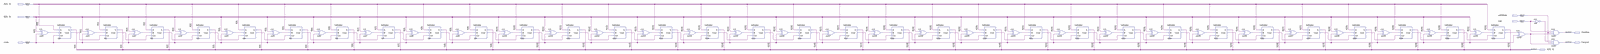
[diagram p0: schematic sheet, whole]
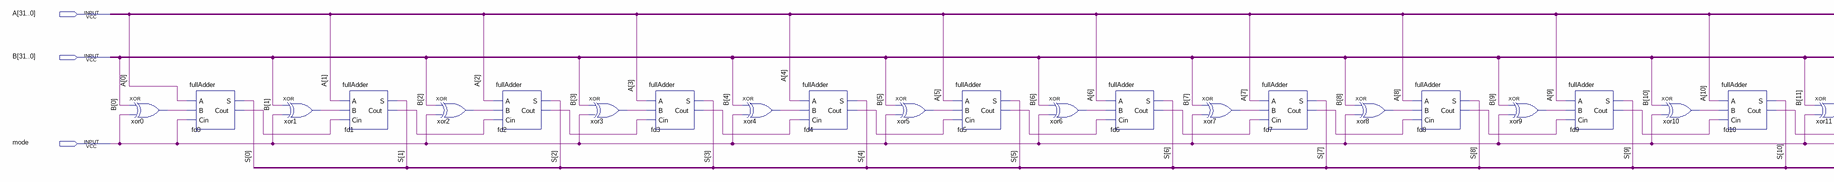
[diagram p1: schematic sheet, left part]
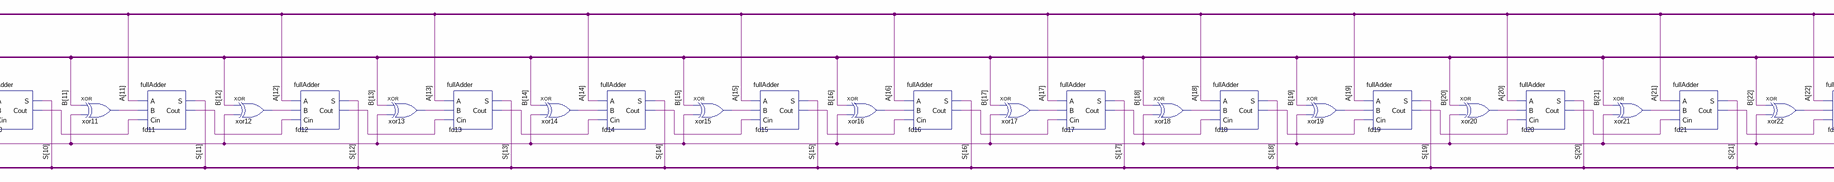
[diagram p2: schematic sheet, centre part]
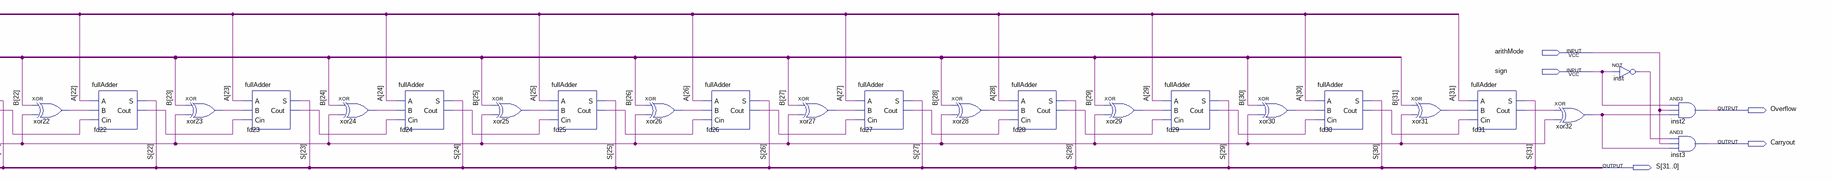
[diagram p3: schematic sheet, right part]
// Quartus schematic fd32.bdf as structural Verilog: 68 symbols, 8 pins
module fd32 (
  input  [31:0] A,
  input  arithMode,
  input  [31:0] B,
  input  sign,
  input  mode,
  output Overflow,
  output Carryout,
  output [31:0] S
);

  wire fd0_cout, fd1_cout, fd2_cout, fd3_cout, fd4_cout, fd5_cout, fd6_cout, fd7_cout, fd8_cout, fd9_cout,
       fd10_cout, fd11_cout, fd12_cout, fd13_cout, fd14_cout, fd15_cout, fd16_cout, fd17_cout, fd18_cout,
       fd19_cout, fd20_cout, fd21_cout, fd22_cout, fd23_cout, fd24_cout, fd25_cout, fd26_cout, fd27_cout,
       fd28_cout, fd29_cout, fd30_cout, fd31_cout, inst_out, xor0_out, xor1_out, xor2_out, xor3_out,
       xor4_out, xor5_out, xor6_out, xor7_out, xor8_out, xor9_out, xor10_out, xor11_out, xor12_out,
       xor13_out, xor14_out, xor15_out, xor16_out, xor17_out, xor18_out, xor19_out, xor20_out, xor21_out,
       xor22_out, xor23_out, xor24_out, xor25_out, xor26_out, xor27_out, xor28_out, xor29_out, xor30_out,
       xor31_out, xor32_out;

  xor xor0 (xor0_out, B[0], mode);
  fullAdder fd0 (.A(A[0]), .B(xor0_out), .Cin(mode), .S(S[0]), .Cout(fd0_cout));
  xor xor1 (xor1_out, B[1], mode);
  fullAdder fd1 (.A(A[1]), .B(xor1_out), .Cin(fd0_cout), .S(S[1]), .Cout(fd1_cout));
  xor xor2 (xor2_out, B[2], mode);
  fullAdder fd2 (.A(A[2]), .B(xor2_out), .Cin(fd1_cout), .S(S[2]), .Cout(fd2_cout));
  xor xor3 (xor3_out, B[3], mode);
  fullAdder fd3 (.A(A[3]), .B(xor3_out), .Cin(fd2_cout), .S(S[3]), .Cout(fd3_cout));
  xor xor4 (xor4_out, B[4], mode);
  fullAdder fd4 (.A(A[4]), .B(xor4_out), .Cin(fd3_cout), .S(S[4]), .Cout(fd4_cout));
  xor xor5 (xor5_out, B[5], mode);
  fullAdder fd5 (.A(A[5]), .B(xor5_out), .Cin(fd4_cout), .S(S[5]), .Cout(fd5_cout));
  xor xor6 (xor6_out, B[6], mode);
  fullAdder fd6 (.A(A[6]), .B(xor6_out), .Cin(fd5_cout), .S(S[6]), .Cout(fd6_cout));
  xor xor7 (xor7_out, B[7], mode);
  fullAdder fd7 (.A(A[7]), .B(xor7_out), .Cin(fd6_cout), .S(S[7]), .Cout(fd7_cout));
  xor xor8 (xor8_out, B[8], mode);
  fullAdder fd8 (.A(A[8]), .B(xor8_out), .Cin(fd7_cout), .S(S[8]), .Cout(fd8_cout));
  xor xor9 (xor9_out, B[9], mode);
  fullAdder fd9 (.A(A[9]), .B(xor9_out), .Cin(fd8_cout), .S(S[9]), .Cout(fd9_cout));
  xor xor10 (xor10_out, B[10], mode);
  fullAdder fd10 (.A(A[10]), .B(xor10_out), .Cin(fd9_cout), .S(S[10]), .Cout(fd10_cout));
  xor xor11 (xor11_out, B[11], mode);
  fullAdder fd11 (.A(A[11]), .B(xor11_out), .Cin(fd10_cout), .S(S[11]), .Cout(fd11_cout));
  xor xor12 (xor12_out, B[12], mode);
  fullAdder fd12 (.A(A[12]), .B(xor12_out), .Cin(fd11_cout), .S(S[12]), .Cout(fd12_cout));
  xor xor13 (xor13_out, B[13], mode);
  fullAdder fd13 (.A(A[13]), .B(xor13_out), .Cin(fd12_cout), .S(S[13]), .Cout(fd13_cout));
  xor xor14 (xor14_out, B[14], mode);
  fullAdder fd14 (.A(A[14]), .B(xor14_out), .Cin(fd13_cout), .S(S[14]), .Cout(fd14_cout));
  xor xor15 (xor15_out, B[15], mode);
  fullAdder fd15 (.A(A[15]), .B(xor15_out), .Cin(fd14_cout), .S(S[15]), .Cout(fd15_cout));
  xor xor16 (xor16_out, B[16], mode);
  fullAdder fd16 (.A(A[16]), .B(xor16_out), .Cin(fd15_cout), .S(S[16]), .Cout(fd16_cout));
  xor xor17 (xor17_out, B[17], mode);
  fullAdder fd17 (.A(A[17]), .B(xor17_out), .Cin(fd16_cout), .S(S[17]), .Cout(fd17_cout));
  xor xor18 (xor18_out, B[18], mode);
  fullAdder fd18 (.A(A[18]), .B(xor18_out), .Cin(fd17_cout), .S(S[18]), .Cout(fd18_cout));
  xor xor19 (xor19_out, B[19], mode);
  fullAdder fd19 (.A(A[19]), .B(xor19_out), .Cin(fd18_cout), .S(S[19]), .Cout(fd19_cout));
  xor xor20 (xor20_out, B[20], mode);
  fullAdder fd20 (.A(A[20]), .B(xor20_out), .Cin(fd19_cout), .S(S[20]), .Cout(fd20_cout));
  xor xor21 (xor21_out, B[21], mode);
  fullAdder fd21 (.A(A[21]), .B(xor21_out), .Cin(fd20_cout), .S(S[21]), .Cout(fd21_cout));
  xor xor22 (xor22_out, B[22], mode);
  fullAdder fd22 (.A(A[22]), .B(xor22_out), .Cin(fd21_cout), .S(S[22]), .Cout(fd22_cout));
  xor xor23 (xor23_out, B[23], mode);
  fullAdder fd23 (.A(A[23]), .B(xor23_out), .Cin(fd22_cout), .S(S[23]), .Cout(fd23_cout));
  xor xor24 (xor24_out, B[24], mode);
  fullAdder fd24 (.A(A[24]), .B(xor24_out), .Cin(fd23_cout), .S(S[24]), .Cout(fd24_cout));
  xor xor25 (xor25_out, B[25], mode);
  fullAdder fd25 (.A(A[25]), .B(xor25_out), .Cin(fd24_cout), .S(S[25]), .Cout(fd25_cout));
  xor xor26 (xor26_out, B[26], mode);
  fullAdder fd26 (.A(A[26]), .B(xor26_out), .Cin(fd25_cout), .S(S[26]), .Cout(fd26_cout));
  xor xor27 (xor27_out, B[27], mode);
  fullAdder fd27 (.A(A[27]), .B(xor27_out), .Cin(fd26_cout), .S(S[27]), .Cout(fd27_cout));
  xor xor28 (xor28_out, B[28], mode);
  fullAdder fd28 (.A(A[28]), .B(xor28_out), .Cin(fd27_cout), .S(S[28]), .Cout(fd28_cout));
  xor xor29 (xor29_out, B[29], mode);
  fullAdder fd29 (.A(A[29]), .B(xor29_out), .Cin(fd28_cout), .S(S[29]), .Cout(fd29_cout));
  xor xor30 (xor30_out, B[30], mode);
  fullAdder fd30 (.A(A[30]), .B(xor30_out), .Cin(fd29_cout), .S(S[30]), .Cout(fd30_cout));
  xor xor31 (xor31_out, B[31], mode);
  fullAdder fd31 (.A(A[31]), .B(xor31_out), .Cin(fd30_cout), .S(S[31]), .Cout(fd31_cout));
  xor xor32 (xor32_out, fd31_cout, mode);
  not inst (inst_out, sign);
  and inst2 (Overflow, sign, arithMode, xor32_out);
  and inst3 (Carryout, inst_out, arithMode, xor32_out);
endmodule
